# EasyEDA schematic SCH_TestCharlieplex1_2025-11-02.json
TITLE: Sheet_1; REV: 1.0; Date: 2025-10-31; Sheet: 1/1; Drawn By: robdobsn; Company: Your Company
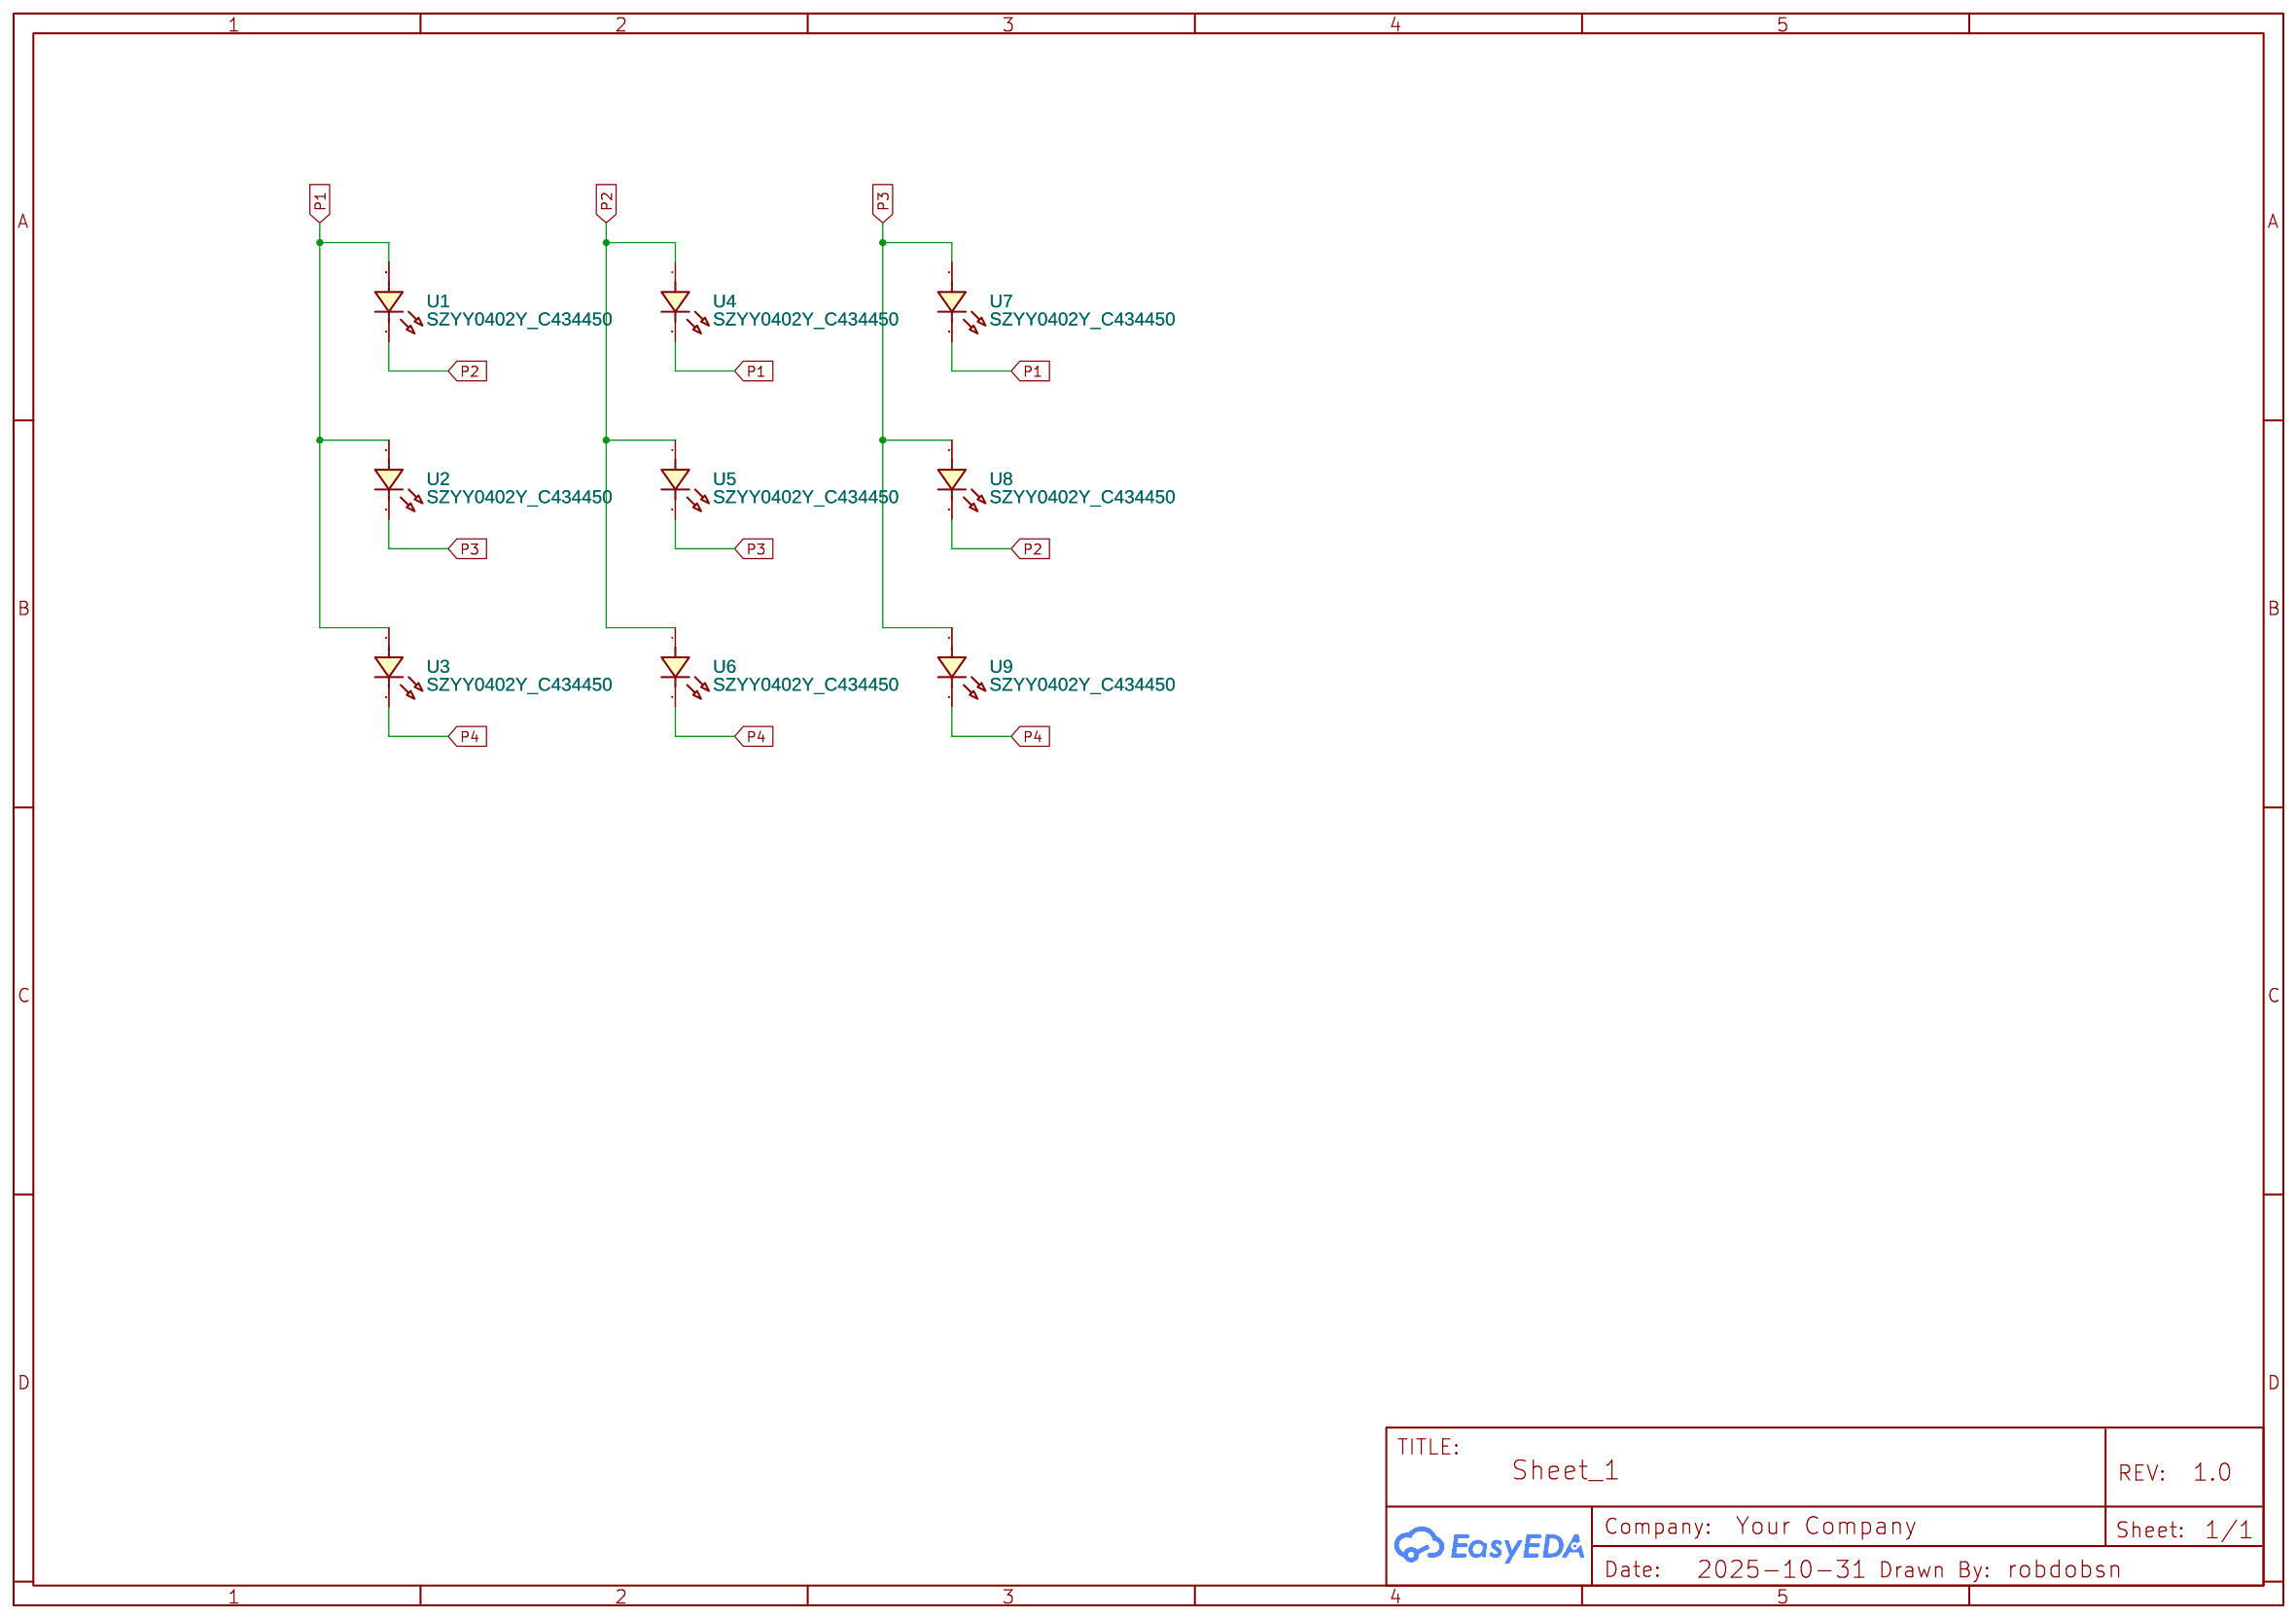
[diagram p0: schematic sheet]

## Parts
U1  SZYY0402Y_C434450  [LED0402-FD_YELLOW]
U2  SZYY0402Y_C434450  [LED0402-FD_YELLOW]
U3  SZYY0402Y_C434450  [LED0402-FD_YELLOW]
U4  SZYY0402Y_C434450  [LED0402-FD_YELLOW]
U5  SZYY0402Y_C434450  [LED0402-FD_YELLOW]
U6  SZYY0402Y_C434450  [LED0402-FD_YELLOW]
U7  SZYY0402Y_C434450  [LED0402-FD_YELLOW]
U8  SZYY0402Y_C434450  [LED0402-FD_YELLOW]
U9  SZYY0402Y_C434450  [LED0402-FD_YELLOW]

## Library data of the parts
U1-U9 = SZYY0402Y_C434450: Contributor: lcsc; Supplier: LCSC; Supplier Part: C434450; Manufacturer: yongyu(永裕光电); Manufacturer Part: SZYY0402Y; JLCPCB Part Class: Extended Part

## Nets
P1: U1.1(A) U2.1(A) U3.1(A) U4.2(K) U7.2(K)
P2: U1.2(K) U4.1(A) U5.1(A) U6.1(A) U8.2(K)
P3: U2.2(K) U5.2(K) U7.1(A) U8.1(A) U9.1(A)
P4: U3.2(K) U6.2(K) U9.2(K)
